# Altium project QUTMS_HVBoard.PrjPcb
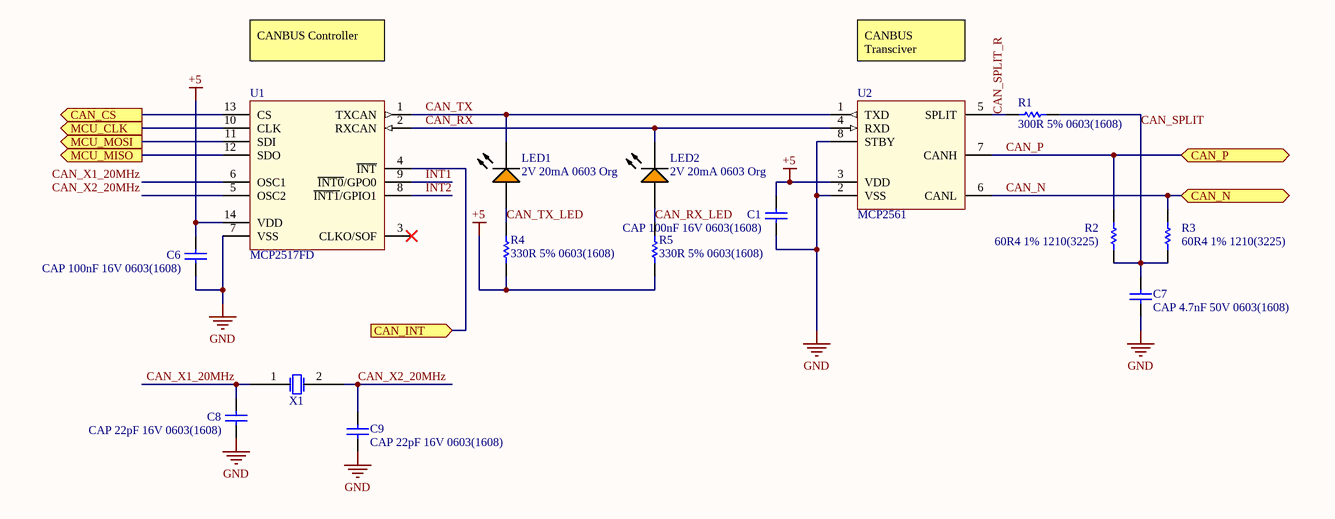
[diagram p0: CAN.SchDoc]
7 sheets, 72 parts. Net scope: flat (ports and power ports of the same name join across sheets).
Board file: Board.PcbDoc
Sheets:
  CAN.SchDoc
  IMD.SchDoc
  TSAL.SchDoc
  LEM.SchDoc
  MCU.SchDoc
  Offboard.SchDoc
  Power.SchDoc

## Sheet CAN.SchDoc: QUTMS - HVBoard - CANBUS
size A4; Author: Jonn Dillon; Organization: QUT Motorsport; Address1: O-120; Address2: O Block; Address3: QUT Gardens Point; Address4: Brisbane, 4000; DocumentNumber: 1; SheetNumber: 1; SheetTotal: 7

### Parts
C1  CAP 100nF 16V 0603(1608)  [CAPC0603(1608)100_N]
C6  CAP 100nF 16V 0603(1608)  [CAPC0603(1608)100_N]
C7  CAP 4.7nF 50V 0603(1608)  [CAPC0603(1608)100_M]
C8  CAP 22pF 16V 0603(1608)  [CAPC0603(1608)100_N]
C9  CAP 22pF 16V 0603(1608)  [CAPC0603(1608)100_N]
LED1  2V 20mA 0603 Org  [KING-LED0603-25-ORANGE_V]
LED2  2V 20mA 0603 Org  [KING-LED0603-25-ORANGE_V]
R1  300R 5% 0603(1608)  [RESC0603(1608)_N]
R2  60R4 1% 1210(3225)  [RESC1210(3225)_L]
R3  60R4 1% 1210(3225)  [RESC1210(3225)_L]
R4  330R 5% 0603(1608)  [RESC0603(1608)_L]
R5  330R 5% 0603(1608)  [RESC0603(1608)_L]
U1  MCP2517FD  [MCP2517FD SOIC]
U2  MCP2561  [MCP2561 SOIC]
X1  Crystal 20MHz  [Crystal 20MHz]  (value not drawn)

### Ports
CAN_CS (out), CAN_INT (in), CAN_N (bidir), CAN_P (bidir), MCU_CLK (out), MCU_MISO (out), MCU_MOSI (out)

### Nets
+5: C1.2 C6.2 R4.2 R5.2 U1.14(VDD) U2.3(VDD)
GND: C1.1 C6.1 C7.1 C8.1 C9.2 U1.7(VSS) U2.2(VSS) U2.8(STBY)
CAN_CS: U1.13(CS) ; port CAN_CS
CAN_INT: U1.4(~{INT}) ; port CAN_INT
CAN_N: R3.2 U2.6(CANL) ; port CAN_N
CAN_P: R2.2 U2.7(CANH) ; port CAN_P
CAN_RX: LED2.2(K) U1.2(RXCAN) U2.4(RXD)
CAN_RX_LED: LED2.1(A) R5.1
CAN_SPLIT: C7.2 R1.2 R2.1 R3.1
CAN_SPLIT_R: R1.1 U2.5(SPLIT)
CAN_TX: LED1.2(K) U1.1(TXCAN) U2.1(TXD)
CAN_TX_LED: LED1.1(A) R4.1
CAN_X1_20MHz: C8.2 U1.6(OSC1) X1.1
CAN_X2_20MHz: C9.1 U1.5(OSC2) X1.2
INT1: U1.9(~{INT0}/GPO0)
INT2: U1.8(~{INT1}/GPIO1)
MCU_CLK: U1.10(CLK) ; port MCU_CLK
MCU_MISO: U1.12(SDO) ; port MCU_MISO
MCU_MOSI: U1.11(SDI) ; port MCU_MOSI

Not connected (* = marked no-connect by the designer): U1 3(CLKO/SOF)*

### Notes on the sheet
- CANBUS Controller
- CANBUS Transciver
- Title
- Size:
- Date:
- A4
- Number:
- Time:
- Revision:
- Sheet
- of
- File:

### Library data of the parts
C1 C6 = CMP-1035-02584-1: CAP 100nF 16V ±10% 0603 (1608 Metric) Thickness 1mm SMD; Tolerance: Â±10%; Case-EIA: 0603; Case-Metric: 1608; Technology: SMT; Max Thickness: 1 mm; Value: 100nF; Rated Voltage: 16 V
C7 = CMP-1035-02202-1: CAP 4.7nF 50V ±5% 0603 (1608 Metric) Thickness 1mm SMD; Case-Metric: 1608; Case-EIA: 0603; Tolerance: Â±5%; Value: 4.7nF; Rated Voltage: 50 V; Technology: SMT; Max Thickness: 1 mm
C8 C9 = CMP-1035-00808-1: CAP 22pF 16V ±5% 0603 (1608 Metric) Thickness 1mm SMD; Tolerance: Â±5%; Case-EIA: 0603; Case-Metric: 1608; Technology: SMT; Value: 22pF; Rated Voltage: 16 V; Max Thickness: 1 mm
LED1 LED2 = CMP-0239-00002-1: LED, SMT, 0603(1608), 0.25mm Tthickness, Super Bright Orange; PartNumber: APG1608SEKC/T; Forward Current: 30 mA; Power Dissipation: 75 mW; Reverse Voltage: 5 V; Packing: Reel; PackageDescription: 2-Pin SMT LED, 1.6 x 0.8 mm Body, 0.25mm Thickness; ComponentLink1URL: http://www.kingbrightusa.com/; PackageVersion: Rev. 4A, 12/2011; Storage Temperature: -40 to 85 degC; Mounting Technology: Surface Mount; ComponentLink2Description: Datasheet; DatasheetVersion: Rev. 4A, 12/2011; ComponentLink2URL: http://www.kingbrightusa.com/images/catalog/SPEC/APG1608SEKC-T.pdf; PackageReference: LED0603-25-ORANGE; ComponentLink1Description: Manufacturer URL
R1 = CMP-1012-00061-1: 300R 0.1W 5% 0603 (1608 Metric)  SMD; Case-EIA: 0603; Value: 300.00 Ohm; Case-Metric: 1608; Tolerance: 5 %; Power: 0.1 W; Technology: SMT
R2 R3 = CMP-1015-00372-1: 60R4 0.5W 1% 1210 (3225 Metric)  SMD; Case-Metric: 3225; Case-EIA: 1210; Value: 60.40 Ohm; Technology: SMT; Tolerance: 1 %; Power: 0.5 W
R4 R5 = CMP-1012-00062-1: 330R 0.1W 5% 0603 (1608 Metric)  SMD; Value: 330.00 Ohm; Case-EIA: 0603; Case-Metric: 1608; Tolerance: 5 %; Power: 0.1 W; Technology: SMT
X1 = Crystal 20MHz: ComponentLink1Description: Datasheet; ComponentLink1URL: http://cfd.citizen.co.jp/english/prod-tech/product/pdf/datasheet_AT/HCM49_E.pdf

## Sheet IMD.SchDoc: QUTMS - HVBoard - IMD
size A4; Author: Jonn Dillon; Organization: QUT Motorsport; Address1: O-120; Address2: O Block; Address3: QUT Gardens Point; Address4: Brisbane, 4000; DocumentNumber: 2; SheetNumber: 2; SheetTotal: 7
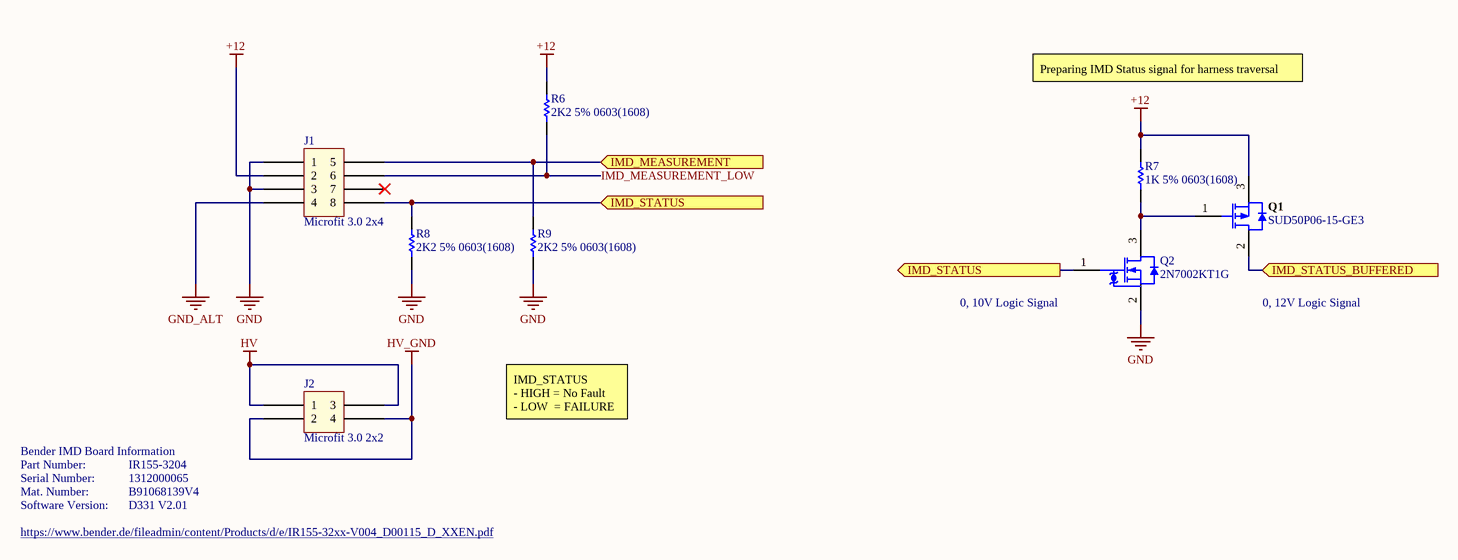
[diagram p1: IMD.SchDoc]

### Parts
J1  Microfit 3.0 2x4  [Microfit_2X4_R_TH]
J2  Microfit 3.0 2x2  [Microfit_2X2_R_TH]
Q1  SUD50P06-15-GE3  [VSIL-TO-252AA-3_V]
Q2  2N7002KT1G  [ONSC-SOT-23-3-318-08_V]
R6  2K2 5% 0603(1608)  [RESC0603(1608)_N]
R7  1K 5% 0603(1608)  [RESC0603(1608)_L]
R8  2K2 5% 0603(1608)  [RESC0603(1608)_N]
R9  2K2 5% 0603(1608)  [RESC0603(1608)_N]

### Ports
IMD_MEASUREMENT (in), IMD_STATUS (in), IMD_STATUS (out), IMD_STATUS_BUFFERED (in)

### Nets
+12: J1.2 Q1.3(S) R6.2 R7.2
GND: J1.1 J1.3 Q2.2(S) R8.1 R9.1
GND_ALT: J1.4
HV: J2.1 J2.3
HV_GND: J2.2 J2.4
IMD_MEASUREMENT: J1.5 R9.2 ; port IMD_MEASUREMENT
IMD_MEASUREMENT_LOW: J1.6 R6.1
IMD_STATUS: J1.8 Q2.1(G) R8.2 ; port IMD_STATUS
NetJ5_10: Q1.2(D) ; port IMD_STATUS_BUFFERED
NetQ1_1: Q1.1(G) Q2.3(D) R7.1

Not connected (* = marked no-connect by the designer): J1 7*

### Notes on the sheet
- Preparing IMD Status signal for harness traversal
- (near Q2) 0, 10V Logic Signal
- 0, 12V Logic Signal
- IMD_STATUS
  - HIGH = No Fault
  - LOW  = FAILURE
- Bender IMD Board Information
- Part Number:
- Serial Number:
- IR155-3204
- 1312000065
- https://www.bender.de/fileadmin/content/Products/d/e/IR155-32xx-V004_D00115_D_XXEN.pdf
- Mat. Number:
- Software Version:
- B91068139V4
- D331 V2.01
- Title
- Size:
- Date:
- A4
- Number:
- Time:
- Revision:
- Sheet
- of
- File:

### Library data of the parts
J1 = Microfit_2x4
J2 = Microfit_2x2
Q1 = CMP-2000-05431-1: P-Channel (D-S) MOSFET, 30 V, -55 to 150 degC, 3-Pin TO-252, RoHS, Tape and Reel; Manufacturer: Vishay; Unit Weight: 0.050717oz; Id - Continuous Drain Current: 50A; Rise Time: 70ns; Fall Time: 175ns; Configuration: Single; Rds On - Drain-Source Resistance: 15mOhms; Transistor Type: 1P-Channel; Channel Mode: Enhancement; Number of Channels: 1Channel; Typical Turn-On Delay Time: 15ns; Brand: VishaySemiconductors; Pd - Power Dissipation: 2.5W; Vds - Drain-Source Breakdown Voltage: -60V; Vgs - Gate-Source Voltage: 20V; Mounting Style: SMD/SMT; Package / Case: TO-252AA-3; Height: 2.39mm; Datasheet Version: Rev. C, 07/2013; Factory Pack Quantity: 2000; RoHS: True; Typical Turn-Off Delay Time: 175ns; Minimum Operating Temperature: -55C; Tradename: TrenchFET; Manufacturer URL: http://www.vishay.com/; Package Description: 3-Pin Surface Mount Device, Body 6.54 x 6.095 mm, Pitch 2.28 mm; Package Reference: TO-252; Transistor Polarity: P-Channel; Technology: Si; Series: SUD; Datasheet URL: https://datasheet.ciiva.com/4444/sud50p06-244530-4444327.pdf; Width: 6.22mm; Product Category: MOSFET; Packaging: Reel; Length: 6.73mm; Package URL: http://www.vishay.com/docs/89975/v15wl45c-m3.pdf; Maximum Operating Temperature: +150C
Q2 = CMP-1058-00766-1: Small Signal MOSFET, 60 V, 380 mA, Single, N-Channel, 3-Pin SOT-23, Pb-Free, Tape and Reel; Manufacturer: On Semiconductor; Crss Typ (pF): 2.2; ID Max (A): 0.38; VGS(th) Max (V): 2.3; V(BR)DSS Min (V): 60; Coss Typ (pF): 4.2; Ciss Typ (pF): 24.5; Channel Polarity: N Channel; VGS Max (V): 20; RoHS: Pb-Free; PackageDescription: 3-Pin Small Outline Transistor, Body 2.92 x 1.3 mm, Pitch 0.95 mm; PackageVersion: Rev. AP, 11/2009; ComponentLink3URL: http://www.onsemi.cn/pub_link/Collateral/318-08.PDF; DatasheetVersion: Rev. 11; ComponentLink1URL: http://www.onsemi.com/; Configuration: Single; PackageReference: SOT-23-3-318-08; Mounting Technology: Surface Mount; Package Type: SOT-23-3; PartNumber: 2N7002KT1G; ComponentLink2Description: Datasheet; Packing: Tape and Reel; ComponentLink3Description: Package Specification; ComponentLink2URL: http://www.onsemi.com/pub_link/Collateral/2N7002K-D.PDF; ComponentLink1Description: Manufacturer URL
R6 R8 R9 = CMP-1012-00082-1: 2K2 0.1W 5% 0603 (1608 Metric)  SMD; Case-Metric: 1608; Value: 2200.00 Ohm; Case-EIA: 0603; Power: 0.1 W; Tolerance: 5 %; Technology: SMT
R7 = CMP-1012-00074-1: 1K 0.1W 5% 0603 (1608 Metric)  SMD; Case-EIA: 0603; Case-Metric: 1608; Value: 1000.00 Ohm; Technology: SMT; Tolerance: 5 %; Power: 0.1 W

## Sheet TSAL.SchDoc: QUTMS - HVBoard - TSAL
size A4; Author: Jonn Dillon; Organization: QUT Motorsport; Address1: O-120; Address2: O Block; Address3: QUT Gardens Point; Address4: Brisbane, 4000; DocumentNumber: 3; SheetNumber: 3; SheetTotal: 7
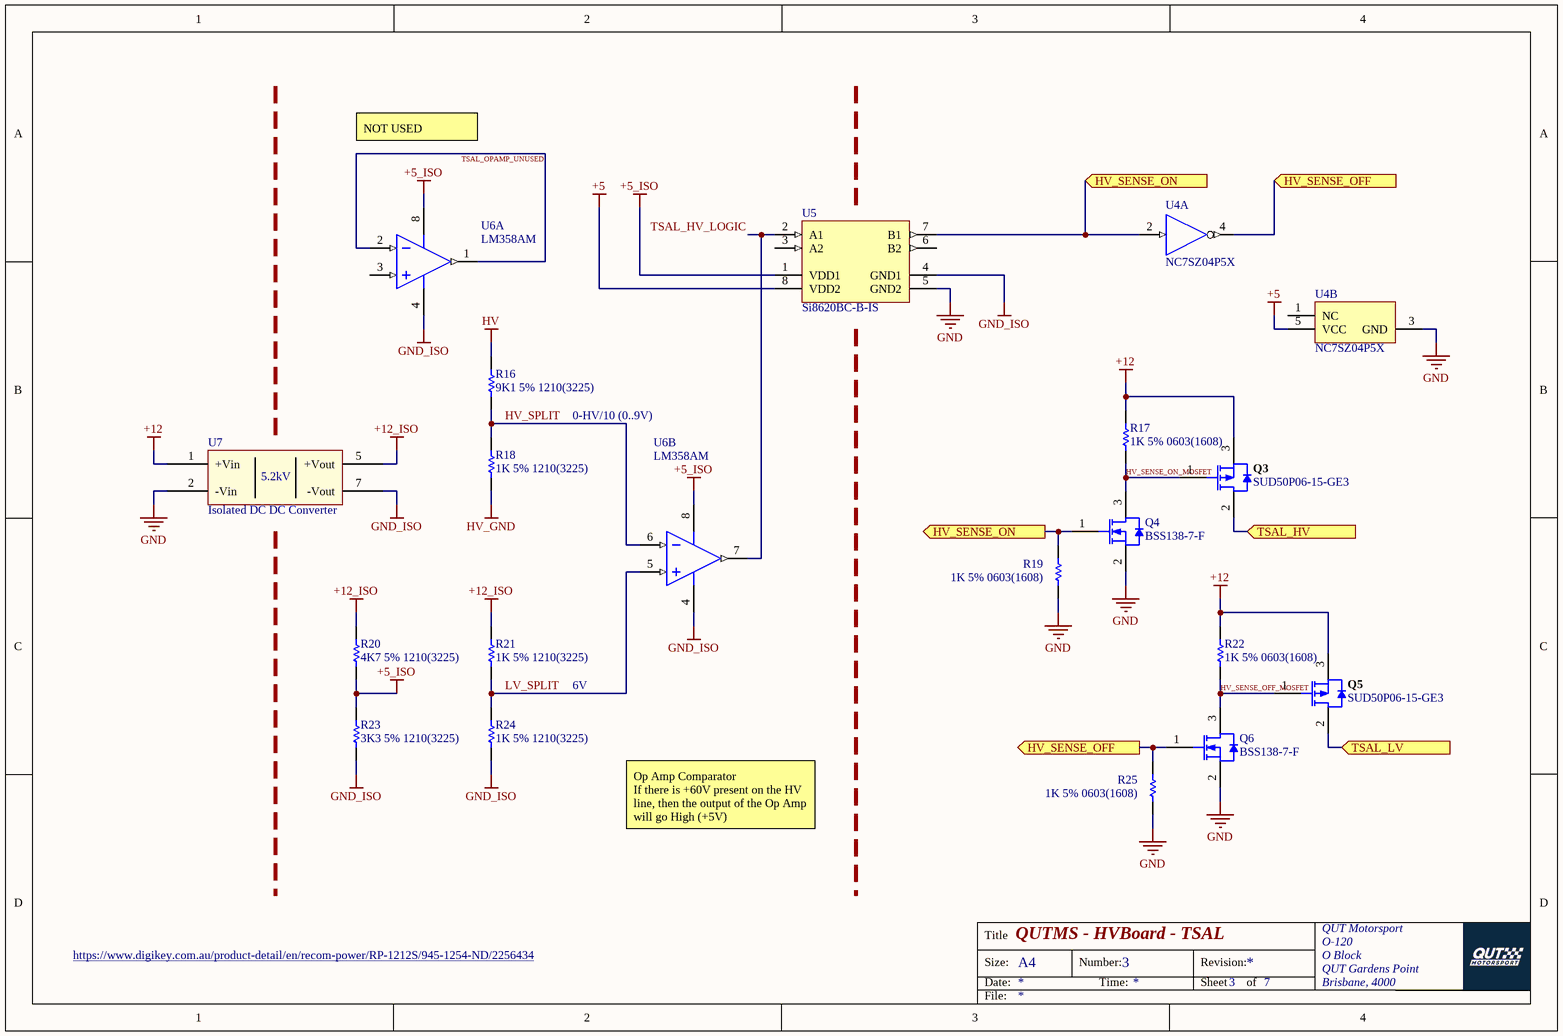
[diagram p2: TSAL.SchDoc]

### Parts
Q3  SUD50P06-15-GE3  [VSIL-TO-252AA-3_V]
Q4  BSS138-7-F  [DIOD-SOT23-3_V]
Q5  SUD50P06-15-GE3  [VSIL-TO-252AA-3_V]
Q6  BSS138-7-F  [DIOD-SOT23-3_V]
R16  9K1 5% 1210(3225)  [RESC1210(3225)_N]
R17  1K 5% 0603(1608)  [RESC0603(1608)_L]
R18  1K 5% 1210(3225)  [RESC1210(3225)_N]
R19  1K 5% 0603(1608)  [RESC0603(1608)_L]
R20  4K7 5% 1210(3225)  [RESC1210(3225)_N]
R21  1K 5% 1210(3225)  [RESC1210(3225)_N]
R22  1K 5% 0603(1608)  [RESC0603(1608)_L]
R23  3K3 5% 1210(3225)  [RESC1210(3225)_N]
R24  1K 5% 1210(3225)  [RESC1210(3225)_N]
R25  1K 5% 0603(1608)  [RESC0603(1608)_L]
U4  NC7SZ04P5X  [FAIR-SC70-5_V]  (parts A,B of 2)
U5  Si8620BC-B-IS  [SLAB-SOIC-8-NB_M]
U6  LM358AM  [D0008A_N]  (parts A,B of 2)
U7  Isolated DC DC Converter  [RP1212S]

### Ports
HV_SENSE_OFF (in), HV_SENSE_OFF (out), HV_SENSE_ON (in), HV_SENSE_ON (out), TSAL_HV (in), TSAL_LV (in)

### Nets
+5: U4.5(VCC) U5.8(VDD2)
+5_ISO: R20.1 R23.2 U5.1(VDD1) U6.8(V+)
+12: Q3.3(S) Q5.3(S) R17.2 R22.2 U7.1(+Vin)
+12_ISO: R20.2 R21.2 U7.5(+Vout)
GND: Q4.2(S) Q6.2(S) R19.1 R25.1 U4.3(GND) U5.5(GND2) U7.2(-Vin)
GND_ISO: R23.1 R24.1 U5.4(GND1) U6.4(GND) U7.7(-Vout)
HV: R16.2
HV_GND: R18.1
HV_SENSE_OFF_MOSFET: Q5.1(G) Q6.3(D) R22.1
HV_SENSE_ON: Q4.1(G) R19.2 U4.2(A) U5.7(B1) ; port HV_SENSE_ON
HV_SENSE_ON_MOSFET: Q3.1(G) Q4.3(D) R17.1
HV_SPLIT: R16.1 R18.2 U6.6(INB-)
LV_SPLIT: R21.1 R24.2 U6.5(INB+)
TSAL_HV_LOGIC: U5.2(A1) U6.7(OUTB)
TSAL_OPAMP_UNUSED: U6.1(OUTA) U6.2(INA-)
NetJ5_4: Q5.2(D) ; port TSAL_LV
NetJ5_9: Q3.2(D) ; port TSAL_HV
NetQ6_1: Q6.1(G) R25.2 U4.4(Y) ; port HV_SENSE_OFF

Not connected (* = marked no-connect by the designer): U4 1(NC); U5 3(A2) 6(B2); U6 3(INA+)

### Notes on the sheet
- NOT USED
- 0-HV/10 (0..9V)
- 6V
- Op Amp Comparator
  If there is +60V present on the HV line, then the output of the Op Amp will go High (+5V)
- https://www.digikey.com.au/product-detail/en/recom-power/RP-1212S/945-1254-ND/2256434
- Title
- Size:
- Date:
- A4
- Number:
- Time:
- Revision:
- Sheet
- of
- File:
- (in symbol RP-1212S) 5.2kV

### Library data of the parts
Q3 Q5 = CMP-2000-05431-1: as Q1 on sheet IMD; Mounting Style: SMD/SMT; Package / Case: TO-252AA-3; Height: 2.39mm; Datasheet Version: Rev. C, 07/2013; Factory Pack Quantity: 2000; RoHS: True; Typical Turn-Off Delay Time: 175ns; Minimum Operating Temperature: -55C; Tradename: TrenchFET; Manufacturer URL: http://www.vishay.com/; Package Description: 3-Pin Surface Mount Device, Body 6.54 x 6.095 mm, Pitch 2.28 mm; Package Reference: TO-252; Transistor Polarity: P-Channel; Technology: Si; Series: SUD; Datasheet URL: https://datasheet.ciiva.com/4444/sud50p06-244530-4444327.pdf; Width: 6.22mm; Product Category: MOSFET; Packaging: Reel; Length: 6.73mm; Package URL: http://www.vishay.com/docs/89975/v15wl45c-m3.pdf; Maximum Operating Temperature: +150C
Q4 Q6 = CMP-2000-04930-1: N-Channel Enhancement Mode Mosfet, 50 V, 0.2 A, -55 to 150 degC, 3-Pin SOT23, RoHS, Tape and Reel; Manufacturer: Diodes Inc; Brand: DiodesIncorporated; Unit Weight: 0.000282oz; Pd - Power Dissipation: 300mW; Id - Continuous Drain Current: 200mA; Rds On - Drain-Source Resistance: 3.5Ohms; Vgs - Gate-Source Voltage: 20V; Number of Channels: 1Channel; Vds - Drain-Source Breakdown Voltage: 50V; Transistor Type: 1N-Channel; Typical Turn-Off Delay Time: 20ns; Configuration: Single; Mounting Style: SMD/SMT; Height: 1mm; Package Description: 3-Pin Small Outline Transistor, Body 2.9 x 1.3 mm, Pitch 0.96 mm; Datasheet Version: Rev. 20-2, 11/2013; Minimum Operating Temperature: -55C; Package / Case: SOT-23-3; Channel Mode: Enhancement; Product: MOSFETSmallSignal; Packaging: Reel; Maximum Operating Temperature: +150C; Datasheet URL: https://datasheet.ciiva.com/8115/ds30144-8115344.pdf; Product Category: MOSFET; Width: 1.3mm; Technology: Si; Package Reference: SOT23-3; Manufacturer URL: http://www.diodes.com/; Transistor Polarity: N-Channel; Length: 2.9mm; Factory Pack Quantity: 3000; Series: BSS138; RoHS: True; Typical Turn-On Delay Time: 20ns
R16 = CMP-1015-00097-1: 9K1 0.5W 5% 1210 (3225 Metric)  SMD; Case-EIA: 1210; Value: 9100.00 Ohm; Case-Metric: 3225; Technology: SMT; Power: 0.5 W; Tolerance: 5 %
R17 R19 R22 R25 = CMP-1012-00074-1: as R7 on sheet IMD; Technology: SMT; Tolerance: 5 %; Power: 0.1 W
R18 R21 R24 = CMP-1015-00074-1: 1K 0.5W 5% 1210 (3225 Metric)  SMD; Case-EIA: 1210; Value: 1000.00 Ohm; Case-Metric: 3225; Power: 0.5 W; Technology: SMT; Tolerance: 5 %
R20 = CMP-1015-00090-1: 4K7 0.5W 5% 1210 (3225 Metric)  SMD; Value: 4700.00 Ohm; Case-Metric: 3225; Case-EIA: 1210; Technology: SMT; Tolerance: 5 %; Power: 0.5 W
R23 = CMP-1015-00086-1: 3K3 0.5W 5% 1210 (3225 Metric)  SMD; Value: 3300.00 Ohm; Case-EIA: 1210; Case-Metric: 3225; Technology: SMT; Tolerance: 5 %; Power: 0.5 W
U4 = CMP-2000-06814-1: TinyLogic(R) UHS Inverter, 32 mA, 1.65 to 5.5 V, -40 to 85 degC, 5-Pin SOT23 (SC70), RoHS, Tape and Reel; Manufacturer: FairchildSemiconductor; Maximum Propagation Delay Time @ Maximum CL: 5@3.3V; Typical Operating Supply Voltage: 1.8; Number of Elements per Chip: 1; Rad Hard: No; Maximum Low Level Output Current: 32mA; Fabrication Technology: CMOS; Propagation Delay Test Condition: 50pF; Maximum High Level Output Current: -32mA; Logic Family: TinyLogicUHS; Package URL: https://www.fairchildsemi.com/package-drawings/MA/MAA05A.pdf; Datasheet Version: Rev. 1.0.5, 02/2011; Package Reference: SC70-5; Package Description: 5-Pin Small Outline Transistor, Body 2 x 1.25 mm, Pitch 0.65 mm; Mounting Technology: SurfaceMount; Logic Function: Inverter; Package: 5SC-70; Category: InverterSchmittTrigger; Packaging: Tape&Reel; Manufacturer URL: https://www.fairchildsemi.com/; Datasheet URL: https://www.fairchildsemi.com/datasheets/NC/NC7SZ04.pdf; Operating Temperature: -40to85°C
U5 = CMP-0512-00372-1: Low-Power Single and Dual-Channel Digital Isolator, 150 Mbps, 3.75 kVRMS Isolation Rating, -40 to 125 degC, 8-pin SOIC; Manufacturer: Silicon Labs; Isolation Rating (kV): 3.75; Channel Type: Unidirectional; AEC-Q100: TRUE; Sub-Family: Isolators; Maximum Propagation Delay (ns): 13; 10kV surge: FALSE; Maximum Data Rate (Mbps): 150; DatasheetVersion: Rev. 1.3; ComponentLink3URL: http://www.silabs.com/Support%20Documents/TechnicalDocs/Si8220-21.pdf; PackageDescription: 8-Pin Narrow Body Plastic Small Outline, Body 4.9 x 3.9 mm, Pitch 1.27 mm; ComponentLink2Description: Datasheet; ComponentLink3Description: Package Specification; ComponentLink1URL: http://www.silabs.com/; ComponentLink1Description: Manufacturer URL; Mounting Technology: Surface Mount; PartNumber: Si8620BC-B-IS; ComponentLink2URL: http://www.silabs.com/Support%20Documents/TechnicalDocs/Si861x-2x.pdf; Enable Control: FALSE; PackageReference: SOIC-8-NB
U6 = CMP-0055-00796-3: Low Power Dual Operational Amplifier, 8-pin Narrow SOIC; Manufacturer: Texas Instruments; CompType: Amplifiers; PackageTopMarking: NSZXTT*LM*358AM; PowerWise: N; Code_JEDEC: MS-012-AA; RoHS: N; PinCount: 8; Package Reference: D0008A; ComponentLink1Description: Datasheet URL; ComponentLink1URL: http://www.ti.com/general/docs/lit/getliterature.tsp?genericPartNumber=LM358-N&fileType=pdf; Code_IPC: SOIC127P600-8; PackageDescription: SOIC Narrow, 4.9 x 3.9 x 1.45mm, 8 Lead, 1.27mm Pitch
U7 = RP-1212S: ComponentLink1Description: DigiKey; ComponentLink1URL: https://www.digikey.com.au/product-detail/en/recom-power/RP-1212S/945-1254-ND/2256434; ComponentLink2Description: Datasheet; ComponentLink2URL: https://www.recom-power.com/pdf/Econoline/RP.pdf

## Sheet LEM.SchDoc: QUTMS - HVBoard - LEM
size A4; Author: Jonn Dillon; Organization: QUT Motorsport; Address1: O-120; Address2: O Block; Address3: QUT Gardens Point; Address4: Brisbane, 4000; DocumentNumber: 4; SheetNumber: 4; SheetTotal: 7
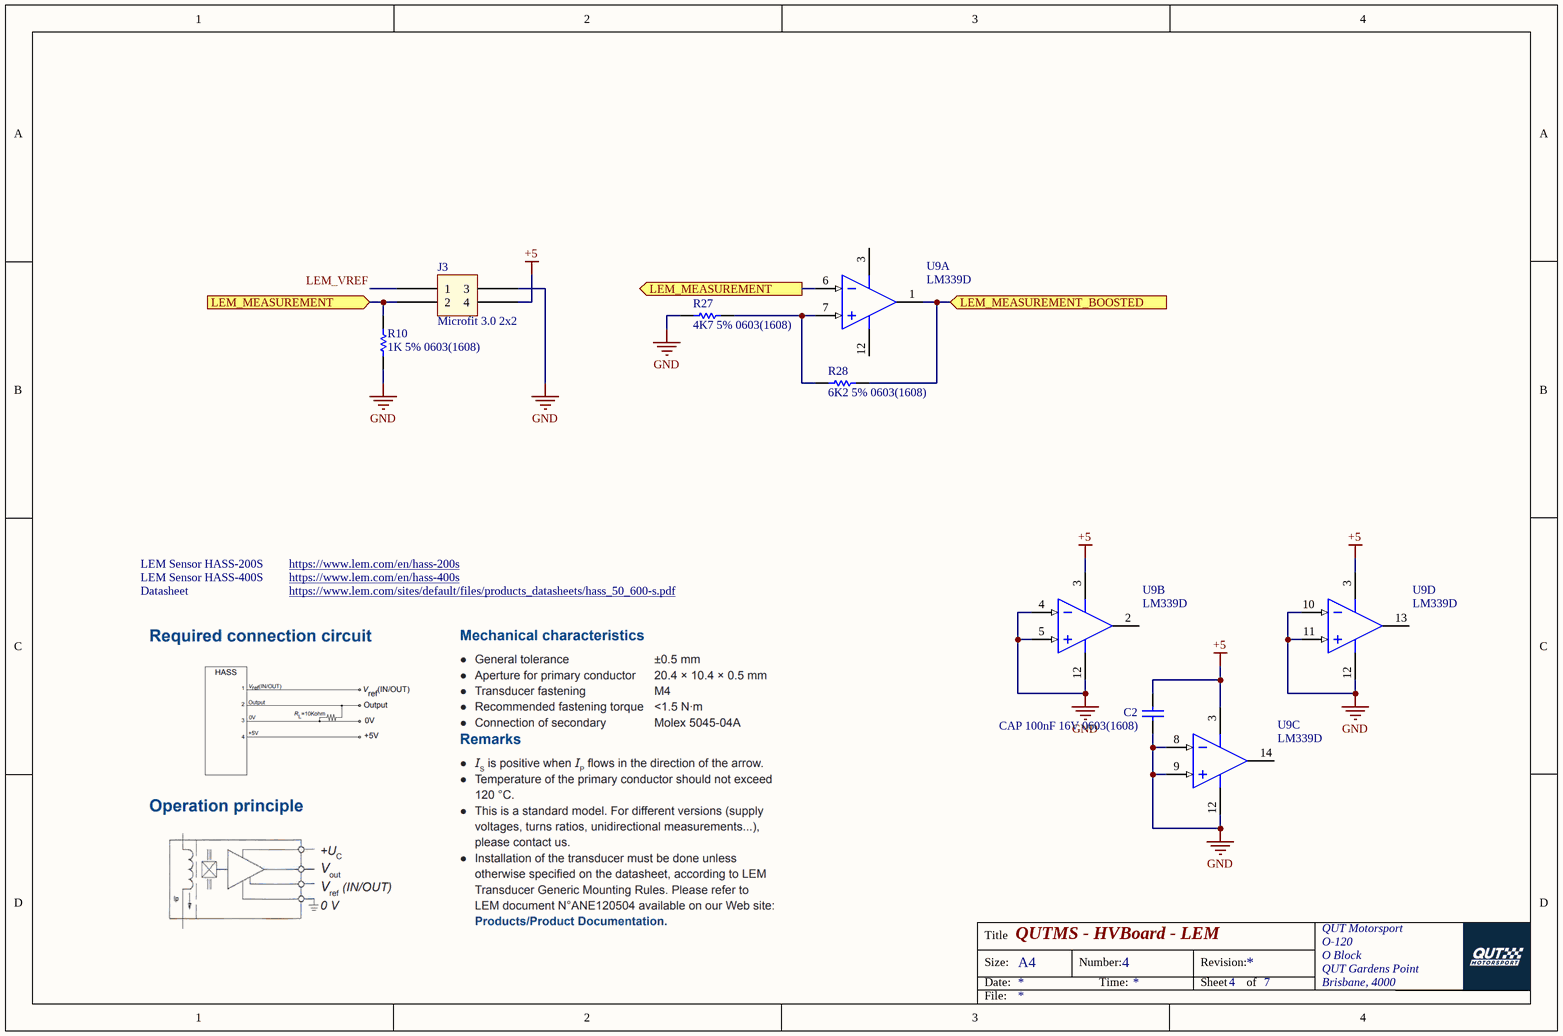
[diagram p3: LEM.SchDoc]

### Parts
C2  CAP 100nF 16V 0603(1608)  [CAPC0603(1608)100_N]
J3  Microfit 3.0 2x2  [Microfit_2X2_R_TH]
R10  1K 5% 0603(1608)  [RESC0603(1608)_L]
R27  4K7 5% 0603(1608)  [RESC0603(1608)_N]
R28  6K2 5% 0603(1608)  [RESC0603(1608)_L]
U9  LM339D  [D0014A_L]  (parts A,B,C,D of 4)

### Ports
LEM_MEASUREMENT (in), LEM_MEASUREMENT (out), LEM_MEASUREMENT_BOOSTED (in)

### Nets
+5: C2.2 J3.4 U9.3(VCC)
GND: C2.1 J3.3 R10.1 R27.2 U9.4(IN2-) U9.5(IN2+) U9.8(IN3-) U9.9(IN3+) U9.10(IN4-) U9.11(IN4+) U9.12(GND)
LEM_MEASUREMENT: J3.2 R10.2 U9.6(IN1-) ; port LEM_MEASUREMENT
LEM_VREF: J3.1
NetJ5_7: R28.2 U9.1(OUT1) ; port LEM_MEASUREMENT_BOOSTED
NetR27_1: R27.1 R28.1 U9.7(IN1+)

Not connected (* = marked no-connect by the designer): U9 2(OUT2) 13(OUT4) 14(OUT3)

### Notes on the sheet
- LEM Sensor HASS-400S
- LEM Sensor HASS-200S
- https://www.lem.com/en/hass-400s
- https://www.lem.com/en/hass-200s
- Datasheet
- https://www.lem.com/sites/default/files/products_datasheets/hass_50_600-s.pdf
- Title
- Size:
- Date:
- A4
- Number:
- Time:
- Revision:
- Sheet
- of
- File:

### Library data of the parts
C2 = CMP-1035-02584-1: as C1 on sheet CAN; Technology: SMT; Max Thickness: 1 mm; Value: 100nF; Rated Voltage: 16 V
J3 = Microfit_2x2
R10 = CMP-1012-00074-1: as R7 on sheet IMD; Technology: SMT; Tolerance: 5 %; Power: 0.1 W
R27 = CMP-1012-00090-1: 4K7 0.1W 5% 0603 (1608 Metric)  SMD; Case-Metric: 1608; Value: 4700.00 Ohm; Case-EIA: 0603; Tolerance: 5 %; Technology: SMT; Power: 0.1 W
R28 = CMP-1012-00093-1: 6K2 0.1W 5% 0603 (1608 Metric)  SMD; Case-Metric: 1608; Value: 6200.00 Ohm; Case-EIA: 0603; Tolerance: 5 %; Power: 0.1 W; Technology: SMT
U9 = CMP-2000-06548-1: Quad Differential Comparator, 2 to 30 V, 0 to 70 degC, 14-pin SOIC (D14), Green (RoHS & no Sb/Br), Tube; Manufacturer: Texas Instruments; Response Time: 300ns; No. of Comparators: 4; Package Version: 4040047-5/M, 06/2011; IC Output Type: CMOS,MOS,TTL; No. of Pins: 14Pins; Supply Voltage Range: 2Vto36V,±1Vto±18V; Product Range: -; Mounting Technology: SurfaceMount; Operating Temperature Min: 0°C; Package URL: http://www.ti.com/lit/ml/mpds177g/mpds177g.pdf; Automotive Qualification Standard: -; Package Description: 14-Pin Small Outline Integrated Circuit, Body 8.65 x 3.9 mm, Pitch 1.27 mm; Comparator Type: Differential; Manufacturer URL: http://www.ti.com/; Comparator Case Style: SOIC; Packaging: CutTape; Package Reference: D14; Datasheet URL: http://www.ti.com/general/docs/lit/getliterature.tsp?genericPartNumber=LM339&fileType=pdf; Datasheet Version: Rev. T, 06/2015; Operating Temperature Max: 70°C

## Sheet MCU.SchDoc: QUTMS - HVBoard - MCU
size A4; Author: Jonn Dillon; Organization: QUT Motorsport; Address1: O-120; Address2: O Block; Address3: QUT Gardens Point; Address4: Brisbane, 4000; DocumentNumber: 5; SheetNumber: 5; SheetTotal: 7
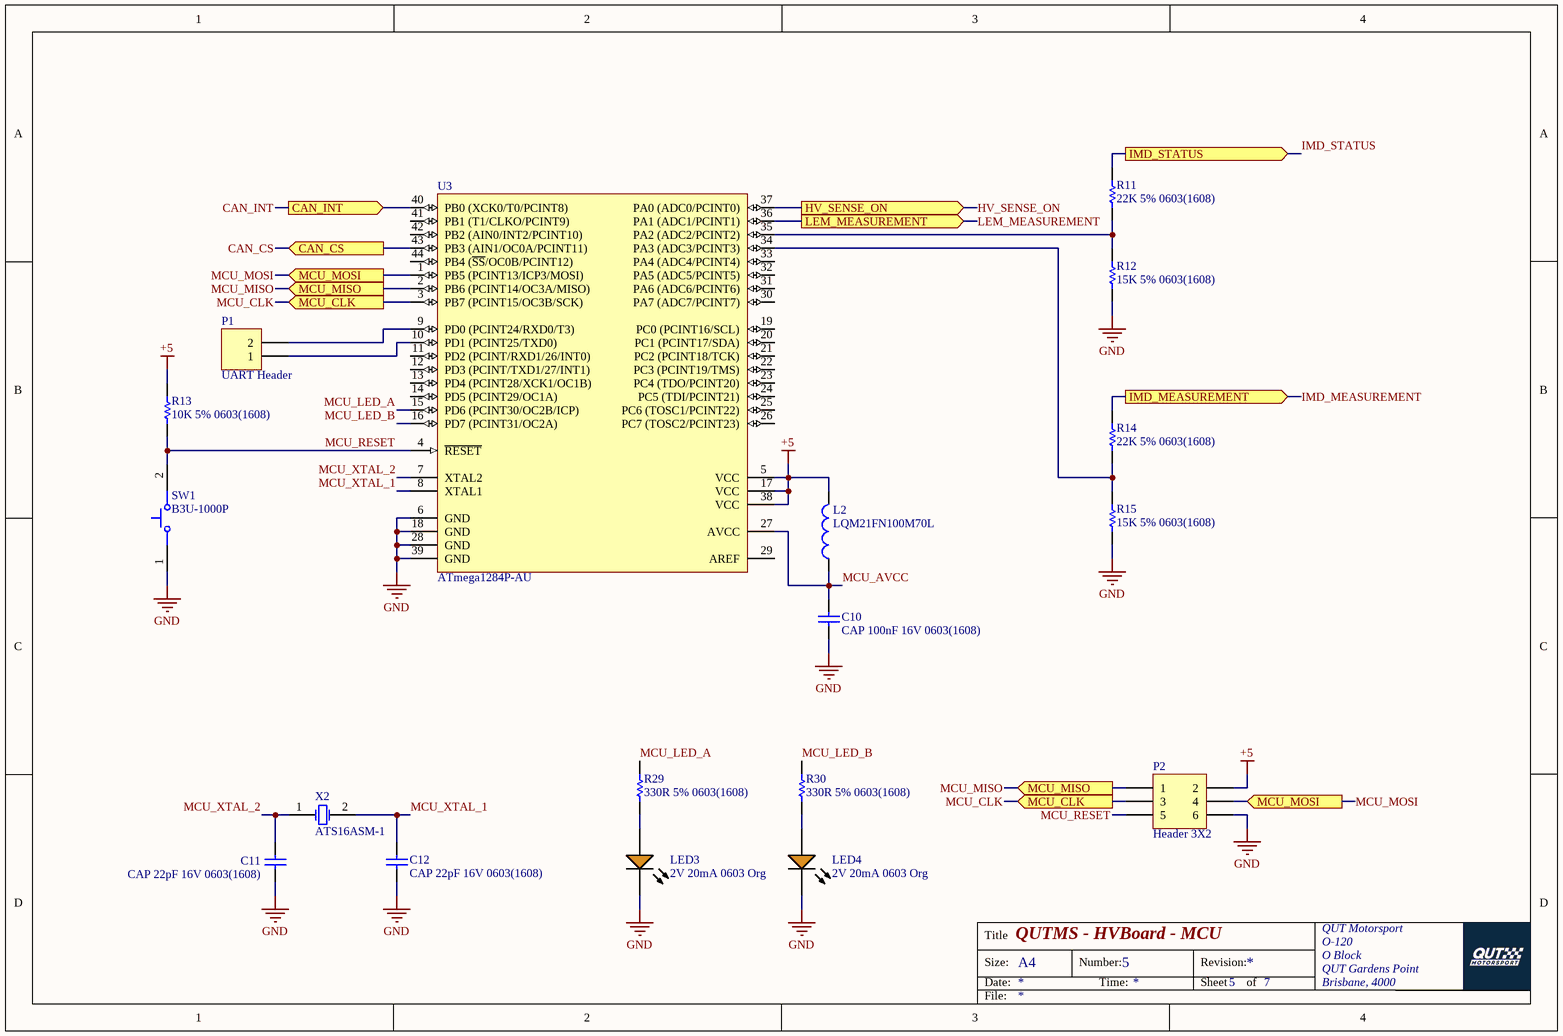
[diagram p4: MCU.SchDoc]

### Parts
C10  CAP 100nF 16V 0603(1608)  [CAPC0603(1608)100_M]
C11  CAP 22pF 16V 0603(1608)  [CAPC0603(1608)100_L]
C12  CAP 22pF 16V 0603(1608)  [CAPC0603(1608)100_L]
L2  LQM21FN100M70L  [MURA-IND0805_L]
LED3  2V 20mA 0603 Org  [KING-LED0603-25-ORANGE_V]
LED4  2V 20mA 0603 Org  [KING-LED0603-25-ORANGE_V]
P1  UART Header  [HDR1X2]
P2  Header 3X2  [HDR2X3]
R11  22K 5% 0603(1608)  [RESC0603(1608)_M]
R12  15K 5% 0603(1608)  [RESC0603(1608)_M]
R13  10K 5% 0603(1608)  [RESC0603(1608)_N]
R14  22K 5% 0603(1608)  [RESC0603(1608)_M]
R15  15K 5% 0603(1608)  [RESC0603(1608)_M]
R29  330R 5% 0603(1608)  [RESC0603(1608)_L]
R30  330R 5% 0603(1608)  [RESC0603(1608)_L]
SW1  B3U-1000P  [OMRON-B3U-1000_V]
U3  ATmega1284P-AU  [44A_N]
X2  ATS16ASM-1  [CTS-ATS-SM-XTAL-2]

### Ports
CAN_CS (in), CAN_INT (out), HV_SENSE_ON (out), IMD_MEASUREMENT (out), IMD_STATUS (out), LEM_MEASUREMENT (out), MCU_CLK (in), MCU_MISO (in), MCU_MOSI (in)

### Nets
+5: L2.2 P2.2 R13.2 U3.5(VCC) U3.17(VCC) U3.38(VCC)
GND: C10.1 C11.1 C12.1 LED3.2(K) LED4.2(K) P2.6 R12.1 R15.1 SW1.1 U3.6(GND) U3.18(GND) U3.28(GND) U3.39(GND)
CAN_CS: U3.43(PB3_(AIN1/OC0A/PCINT11)) ; port CAN_CS
CAN_INT: U3.40(PB0_(XCK0/T0/PCINT8)) ; port CAN_INT
HV_SENSE_ON: U3.37(PA0_(ADC0/PCINT0)) ; port HV_SENSE_ON
IMD_MEASUREMENT: R14.2 ; port IMD_MEASUREMENT
IMD_STATUS: R11.2 ; port IMD_STATUS
LEM_MEASUREMENT: U3.36(PA1_(ADC1/PCINT1)) ; port LEM_MEASUREMENT
MCU_AVCC: C10.2 L2.1 U3.27(AVCC)
MCU_CLK: P2.3 U3.3(PB7_(PCINT15/OC3B/SCK)) ; port MCU_CLK
MCU_LED_A: R29.1 U3.15(PD6_(PCINT30/OC2B/ICP))
MCU_LED_B: R30.1 U3.16(PD7_(PCINT31/OC2A))
MCU_MISO: P2.1 U3.2(PB6_(PCINT14/OC3A/MISO)) ; port MCU_MISO
MCU_MOSI: P2.4 U3.1(PB5_(PCINT13/ICP3/MOSI)) ; port MCU_MOSI
MCU_RESET: P2.5 R13.1 SW1.2 U3.4(~{RESET})
MCU_XTAL_1: C12.2 U3.8(XTAL1) X2.2(X2)
MCU_XTAL_2: C11.2 U3.7(XTAL2) X2.1(X1)
NetLED3_1: LED3.1(A) R29.2
NetLED4_1: LED4.1(A) R30.2
NetP1_1: P1.1 U3.10(PD1_(PCINT25/TXD0))
NetP1_2: P1.2 U3.9(PD0_(PCINT24/RXD0/T3))
NetR11_1: R11.1 R12.2 U3.35(PA2_(ADC2/PCINT2))
NetR14_1: R14.1 R15.2 U3.34(PA3_(ADC3/PCINT3))

Not connected (* = marked no-connect by the designer): U3 11(PD2_(PCINT/RXD1/26/INT0)) 12(PD3_(PCINT/TXD1/27/INT1)) 13(PD4_(PCINT28/XCK1/OC1B)) 14(PD5_(PCINT29/OC1A)) 19(PC0_(PCINT16/SCL)) 20(PC1_(PCINT17/SDA)) 21(PC2_(PCINT18/TCK)) 22(PC3_(PCINT19/TMS)) 23(PC4_(TDO/PCINT20)) 24(PC5_(TDI/PCINT21)) 25(PC6_(TOSC1/PCINT22)) 26(PC7_(TOSC2/PCINT23)) 29(AREF) 30(PA7_(ADC7/PCINT7)) 31(PA6_(ADC6/PCINT6)) 32(PA5_(ADC5/PCINT5)) 33(PA4_(ADC4/PCINT4)) 41(PB1_(T1/CLKO/PCINT9)) 42(PB2_(AIN0/INT2/PCINT10)) 44(PB4_(~{SS}/OC0B/PCINT12))

### Notes on the sheet
- Title
- Size:
- Date:
- A4
- Number:
- Time:
- Revision:
- Sheet
- of
- File:

### Library data of the parts
C10 = CMP-1035-02583-1: CAP 100nF 16V ±5% 0603 (1608 Metric) Thickness 1mm SMD; Tolerance: Â±5%; Case-Metric: 1608; Case-EIA: 0603; Rated Voltage: 16 V; Max Thickness: 1 mm; Technology: SMT; Value: 100nF
C11 C12 = CMP-1035-00806-1: CAP 22pF 16V ±1% 0603 (1608 Metric) Thickness 1mm SMD; Tolerance: Â±1%; Case-EIA: 0603; Case-Metric: 1608; Value: 22pF; Max Thickness: 1 mm; Rated Voltage: 16 V; Technology: SMT
L2 = CMP-2000-06587-1: Fixed Inductor, 10 uH, +/-20%, -55 to 125 degC, 2-Pin SMD (0805), RoHS, Tape and Reel; Manufacturer: Murata; Tolerance (%): 20%; DC Resistance: 0.6; Inductance-Nom: 10H; Rated Current-Max: 100mA; Package Reference: IND0805; Case Size/Dimension: 0805; Manufacturer URL: http://www.murata.com/; Package Description: 2-Pin Surface Mount Device, Body 2 x 1.25 mm; Datasheet URL: http://psearch.en.murata.com/inductor/product/LQM21FN100M70%23.pdf; Mounting Technology: SurfaceMount; Datasheet Version: 05/2016
LED3 LED4 = CMP-0239-00002-1: as LED1 on sheet CAN; PackageDescription: 2-Pin SMT LED, 1.6 x 0.8 mm Body, 0.25mm Thickness; ComponentLink1URL: http://www.kingbrightusa.com/; PackageVersion: Rev. 4A, 12/2011; Storage Temperature: -40 to 85 degC; Mounting Technology: Surface Mount; ComponentLink2Description: Datasheet; DatasheetVersion: Rev. 4A, 12/2011; ComponentLink2URL: http://www.kingbrightusa.com/images/catalog/SPEC/APG1608SEKC-T.pdf; PackageReference: LED0603-25-ORANGE; ComponentLink1Description: Manufacturer URL
P1 = Header 2: LatestRevisionDate: 17-Jul-2002; LatestRevisionNote: Re-released for DXP Platform.; Publisher: Altium Limited
P2 = Header 3X2: Header, 3-Pin, Dual row; LatestRevisionDate: 17-Jul-2002; LatestRevisionNote: Re-released for DXP Platform.; Publisher: Altium Limited
R11 R14 = CMP-1012-00106-1: 22K 0.1W 5% 0603 (1608 Metric)  SMD; Case-Metric: 1608; Value: 22000.00 Ohm; Case-EIA: 0603; Power: 0.1 W; Tolerance: 5 %; Technology: SMT
R12 R15 = CMP-1012-00102-1: 15K 0.1W 5% 0603 (1608 Metric)  SMD; Value: 15000.00 Ohm; Case-Metric: 1608; Case-EIA: 0603; Power: 0.1 W; Technology: SMT; Tolerance: 5 %
R13 = CMP-1012-00098-1: 10K 0.1W 5% 0603 (1608 Metric)  SMD; Case-EIA: 0603; Value: 10000.00 Ohm; Case-Metric: 1608; Technology: SMT; Tolerance: 5 %; Power: 0.1 W
R29 R30 = CMP-1012-00062-1: as R4 on sheet CAN; Tolerance: 5 %; Power: 0.1 W; Technology: SMT
SW1 = CMP-2100-03586-1: Ultra-Small Tactile Switch, 0.05 A, 12 V, -25 to 70 degC, 2-Pin SMD, RoHS, Tape and Reel; Manufacturer: Omron Electronic Components; Operating Force: 1.5N; Current Rating: 50mA; Voltage Rating (DC): 12V; Electrical Life: 200000Cycles; Actuator Length: 0.4mm; Insulation Resistance: 100MOhm; Switch Travel: 0.15mm; Throw Configuration: SPST; Illumination Type: Illuminated; Width: 3mm; Weight: 0.022g; Datasheet Version: 42005.0; Datasheet URL: http://www.omron.com/ecb/products/pdf/en-b3u.pdf; Height: 1.2mm; Package Quantity: 1; REACH SVHC: Unknown; Contact Current Rating: 50mA; Contact Material: Silver; Max Current Rating: 50mA; Package Reference: B3U-1000; Termination: SMD/SMT; Packaging: TapeandReel; Manufacturer URL: http://www.omron.com/; RoHSCompliant: true; Mount: SurfaceMount; Length: 4mm; Min Operating Temperature: -25degC; Depth: 2.5mm; Lead Free: LeadFree; Case/Package: SMD/SMT; Package Description: 2-Pin Surface Mount Device, Body 3 x 2.5 mm; Max Operating Temperature: 70degC; Orientation: Straight
U3 = CMP-0095-00577-1: 8-bit AVR Microcontroller, 128KB Flash, 4KB EEPROM, 16KB SRAM, 44-pin TQFP, Industrial Grade (-40°C to 85°C); PackageReference: 44A; Code_JEDEC: MS-026-ACB; ComponentLink3Description: ATmega164A/164PA/324A/324PA/644A/644PA/1284/1284P Summary; DatasheetVersion: revC, Jun-2011; PackageDescription: 44-Pin Plastic Thin Profile Quad Flat Pack, 10 x 10 x 1.0 mm Body, 0.8 mm Pitch (TQFP); ComponentLink3URL: http://www.atmel.com/dyn/resources/prod_documents/8272S.pdf; ComponentLink1URL: http://www.atmel.com/; ComponentLink1Description: Manufacturer URL; ComponentLink2Description: ATmega164A/164PA/324A/324PA/644A/644PA/1284/1284P Datasheet; ComponentLink2URL: http://www.atmel.com/dyn/resources/prod_documents/doc8272.pdf; PackageVersion: revC, Oct-2010
X2 = CMP-0585-00002-2: ATS-SM Series Quartz Crystal, 16 MHz, -20 to 70 degC, 11.1 x 4.83 x 4.3mm SMD, RoHS, Tape and Reel; Manufacturer: CTS Corporation; Shunt Capacitance (C0): 7.0 pF Max; Frequency: 16 MHz; Oscillation Mode: Fundamental or 3rd Overtone; Crystal Cut: AT-Cut; ESR Maximum: 40 Ohms; Drive Level (Type): 100 uW; PackageDescription: 2-Pin SMD, Body 11.1 x 4.83 mm, Pitch 8.5 mm; PackageReference: ATS-SM-XTAL-2; ComponentLink1URL: http://www.ctscorp.com/; PartNumber: ATS16ASM-1; RoHS: TRUE; ComponentLink1Description: Manufacturer URL; Operating Temperature: -20 to 70 degC; DatasheetVersion: Rev. K; ComponentLink2Description: Datasheet; Packing: Tape and Reel; ComponentLink2URL: http://www.ctscorp.com/components/Datasheets/008-0309-0.pdf; Mounting Technology: Surface Mount; ComponentLink3URL: http://www.ctscorp.com/components/Datasheets/008-0309-0.pdf; ComponentLink3Description: Package Specification

## Sheet Offboard.SchDoc: QUTMS - HVBoard - Offboard
size A4; Author: Jonn Dillon; Organization: QUT Motorsport; Address1: O-120; Address2: O Block; Address3: QUT Gardens Point; Address4: Brisbane, 4000; DocumentNumber: 6; SheetNumber: 6; SheetTotal: 7
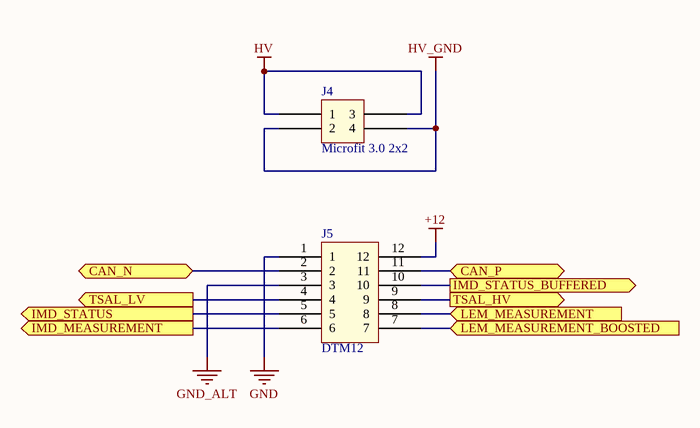
[diagram p5: Offboard.SchDoc]

### Parts
J4  Microfit 3.0 2x2  [Microfit_2X2_R_TH]
J5  DTM12  [DTM13-12PA]

### Ports
CAN_N (bidir), CAN_P (bidir), IMD_MEASUREMENT (out), IMD_STATUS (out), IMD_STATUS_BUFFERED (out), LEM_MEASUREMENT (in), LEM_MEASUREMENT_BOOSTED (in), TSAL_HV (out), TSAL_LV (out)

### Nets
+12: J5.12
GND: J5.1
GND_ALT: J5.3
HV: J4.1 J4.3
HV_GND: J4.2 J4.4
CAN_N: J5.2 ; port CAN_N
CAN_P: J5.11 ; port CAN_P
IMD_MEASUREMENT: J5.6 ; port IMD_MEASUREMENT
IMD_STATUS: J5.5 ; port IMD_STATUS
LEM_MEASUREMENT: J5.8 ; port LEM_MEASUREMENT
NetJ5_4: J5.4 ; port TSAL_LV
NetJ5_7: J5.7 ; port LEM_MEASUREMENT_BOOSTED
NetJ5_9: J5.9 ; port TSAL_HV
NetJ5_10: J5.10 ; port IMD_STATUS_BUFFERED

### Notes on the sheet
- Title
- Size:
- Date:
- A4
- Number:
- Time:
- Revision:
- Sheet
- of
- File:

### Library data of the parts
J4 = Microfit_2x2

## Sheet Power.SchDoc
size A4; Author: Jonn Dillon; Organization: QUT Motorsport; Address1: O-120; Address2: O Block; Address3: QUT Gardens Point; Address4: Brisbane, 4000; DocumentNumber: 7; SheetNumber: 7; SheetTotal: 7
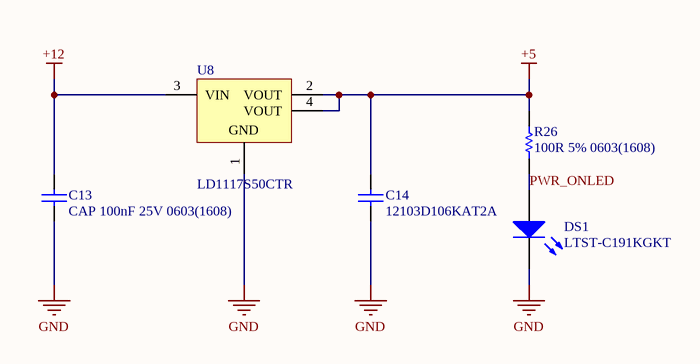
[diagram p6: Power.SchDoc]

### Parts
C13  CAP 100nF 25V 0603(1608)  [CAPC0603(1608)100_N]
C14  12103D106KAT2A  [CAPC3225X279X50LL20T25]
DS1  LTST-C191KGKT  [LITE-ON-LTST-C191KRKT-2_V]
R26  100R 5% 0603(1608)  [RESC0603(1608)_L]
U8  LD1117S50CTR  [SOT-223_N]

### Nets
+5: C14.2 R26.2 U8.2(VOUT) U8.4(VOUT)
+12: C13.2 U8.3(VIN)
GND: C13.1 C14.1 DS1.2(K) U8.1(GND)
PWR_ONLED: DS1.1(A) R26.1

### Notes on the sheet
- Title
- Size:
- Date:
- A4
- Number:
- Time:
- Revision:
- Sheet
- of
- File:

### Library data of the parts
C13 = CMP-1035-02587-1: CAP 100nF 25V ±5% 0603 (1608 Metric) Thickness 1mm SMD; Case-EIA: 0603; Tolerance: Â±5%; Case-Metric: 1608; Technology: SMT; Max Thickness: 1 mm; Rated Voltage: 25 V; Value: 100nF
C14 = CMP-2000-05477-1: Chip Capacitor, 10 uF, +/- 10%, 25 V, -55 to 85 degC, 1210 (3225 Metric), RoHS, Tape and Reel; Manufacturer: AVX; Product Training Modules: ComponentSolutionsforSmartMeterApplications; Capacitance: 10µF; Catalog Drawings: AT2A_1210_2.79; Voltage - Rated: 25V; Other Names: 478-1627-6; Online Catalog: X5RDielectric(D); Temperature Coefficient: X5R; Package Reference: 1210; Lead Style: -; Manufacturer URL: http://www.avx.com/; Datasheet Version: 05/2016; Ratings: -; Mounting Technology: SurfaceMount; Datasheet URL: http://datasheets.avx.com/cx5r.pdf; Package Description: 2-Pin Surface Mount Device, Body 3.2 x 2.5 mm; Applications: GeneralPurpose; Features: -; Tolerance: ±10%; Package / Case: 1210(3225Metric); Lead Spacing: -; Series: -; Mounting Type: SurfaceMount,MLCC; Family: CeramicCapacitors; Standard Package: 1; Category: Capacitors; Packaging: Digi-Reel®; Thickness (Max): 0.110"(2.79mm); Operating Temperature: -55°C~85°C; Size / Dimension: 0.126"Lx0.098"W(3.20mmx2.50mm); Height - Seated (Max): -
DS1 = CMP-2000-05198-1: Chip LED, Green, 574 nm, 40 pF, -55 to 85 degC, 2-Pin SMD, RoHS, Tape and Reel; Manufacturer: Lite-On; Rad Hardened: No; Emitting Color: YellowGreen; Product Height (mm): 0.55mm; Forward Voltage: 2.4V; Number of Elements: 1; Dominant Wave Length: 571nm; DELETED: Compliant; Viewing Angle: 130deg; High Brightness: Yes; Peak Wavelength: 574nm; Type: Uni-Color; Forward Current: 30mA; Product Length (mm): 1.6mm; Luminous Intensity: 35mcd; Test Current (It): 20mA; Chip Material: AlGaInP; Product Depth (mm): 0.8mm; Shape Type: Rectangular; Reverse Voltage: 5V; Power Dissipation: 75W; Pin Count: 2; Lens Dimensions: 1.1X0.8X0.37mm; Packaging: TapeandReel; Main Category: ChipLED; Operating Temperature Classification: Industrial; Package Type: ChipLed; Mounting: SurfaceMount; Lum Intensity: 35mcd; Operating Temp Range: -55Cto85C; Datasheet Version: Jan-07; Datasheet URL: http://download.siliconexpert.com/pdfs/2007/08/26/semi_b/manual/lot/ds/ltst-c191kgkt.pdf; Manufacturer URL: http://www.us.liteon.com/
R26 = CMP-1012-00050-1: 100R 0.1W 5% 0603 (1608 Metric)  SMD; Case-EIA: 0603; Value: 100.00 Ohm; Case-Metric: 1608; Tolerance: 5 %; Technology: SMT; Power: 0.1 W
U8 = CMP-0244-00311-1: Fixed Low Drop Positive Voltage Regulator, 5V, 4-Pin SOT-223, Tape and Reel; PackageReference: SOT-223; PackageVersion: 2010; ComponentLink2URL: http://www.st.com/internet/com/TECHNICAL_RESOURCES/TECHNICAL_LITERATURE/DATASHEET/CD00000544.pdf; ComponentLink1URL: http://www.st.com; ComponentLink2Description: Datasheet; DatasheetVersion: 1/11/2011; ComponentLink1Description: Manufacturer URL; PackageDescription: 4-Pin SOT-223 Package, 6.5 x 3.5 mm Body, 2.3 mm Pitch, 7 mm Lead Span

## Nets that join several sheets
+5: CAN (6 pins), TSAL (U4.5 U5.8), LEM (C2.2 J3.4 U9.3), MCU (6 pins), Power (C14.2 R26.2 U8.2 U8.4)
+12: IMD (J1.2 Q1.3 R6.2 R7.2), TSAL (5 pins), Offboard (J5.12), Power (C13.2 U8.3)
GND: CAN (8 pins), IMD (5 pins), TSAL (7 pins), LEM (11 pins), MCU (13 pins), Offboard (J5.1), Power (C13.1 C14.1 DS1.2 U8.1)
GND_ALT: IMD (J1.4), Offboard (J5.3)
HV: IMD (J2.1 J2.3), TSAL (R16.2), Offboard (J4.1 J4.3)
HV_GND: IMD (J2.2 J2.4), TSAL (R18.1), Offboard (J4.2 J4.4)
CAN_CS: CAN (U1.13), MCU (U3.43)
CAN_INT: CAN (U1.4), MCU (U3.40)
CAN_N: CAN (R3.2 U2.6), Offboard (J5.2)
CAN_P: CAN (R2.2 U2.7), Offboard (J5.11)
HV_SENSE_ON: TSAL (Q4.1 R19.2 U4.2 U5.7), MCU (U3.37)
IMD_MEASUREMENT: IMD (J1.5 R9.2), MCU (R14.2), Offboard (J5.6)
IMD_STATUS: IMD (J1.8 Q2.1 R8.2), MCU (R11.2), Offboard (J5.5)
LEM_MEASUREMENT: LEM (J3.2 R10.2 U9.6), MCU (U3.36), Offboard (J5.8)
MCU_CLK: CAN (U1.10), MCU (P2.3 U3.3)
MCU_MISO: CAN (U1.12), MCU (P2.1 U3.2)
MCU_MOSI: CAN (U1.11), MCU (P2.4 U3.1)
NetJ5_4: TSAL (Q5.2), Offboard (J5.4)
NetJ5_7: LEM (R28.2 U9.1), Offboard (J5.7)
NetJ5_9: TSAL (Q3.2), Offboard (J5.9)
NetJ5_10: IMD (Q1.2), Offboard (J5.10)